# Altium schematic sheet Debugger.SchDoc
size A
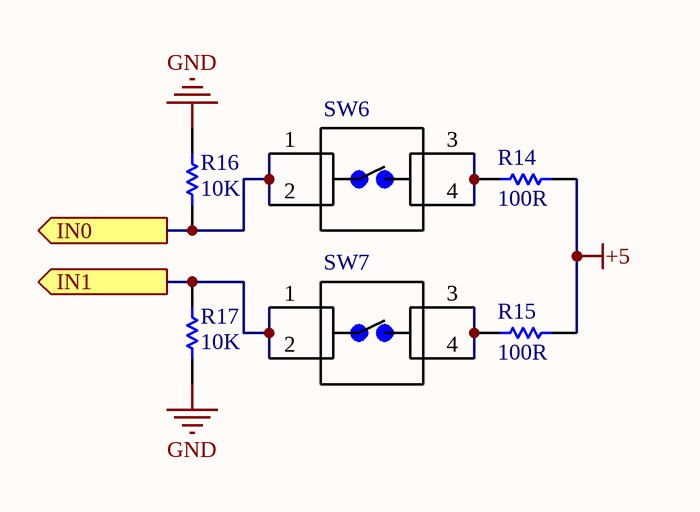
[diagram p0: Debugger.SchDoc]

## Parts
R14  100R  [RESC0805(2012)_L]
R15  100R  [RESC0805(2012)_L]
R16  10K  [RESC0805(2012)_L]
R17  10K  [RESC0805(2012)_L]
SW6  1825910-7  [Switch 6mm 24V (NO)]  (value not drawn)
SW7  1825910-7  [Switch 6mm 24V (NO)]  (value not drawn)

## Ports
IN0 (out), IN1 (out)

## Nets
+5: R14.1 R15.1
GND: R16.2 R17.1
IN0: R16.1 SW6.1 SW6.2 ; port IN0
IN1: R17.2 SW7.1 SW7.2 ; port IN1
NetR14_2: R14.2 SW6.3 SW6.4
NetR15_2: R15.2 SW7.3 SW7.4

## Library data of the parts
R14 R15 = CMP-1013-00397-1: 100R 0.125W 1% 0805 (2012 Metric)  SMD; Value: 100.00 Ohm; Case-Metric: 2012; Case-EIA: 0805; Technology: SMT; Power: 0.125 W; Tolerance: 1 %
R16 R17 = CMP-1013-00624-1: 10K2 0.125W 1% 0805 (2012 Metric)  SMD; Case-Metric: 2012; Case-EIA: 0805; Value: 10200.00 Ohm; Technology: SMT; Tolerance: 1 %; Power: 0.125 W
SW6 SW7 = Switch 6mm 24V (NO): FSM4JAH=6MM TACT SWITCH, HIGH TEMP; MF: TE Connectivity; Contact_Current_Rating: 50 mA; Configuration_Pole-Throw: Single Pole - Single Throw; Package: None; Digi-Key_Part_Number: 450-1804-ND; Digi-Key_Purchase_URL: https://www.digikey.com/product-detail/en/te-connectivity-alcoswitch-switches/1825910-7/450-1804-ND/1731414?utm_source=snapeda&utm_medium=aggregator&utm_campaign=symbol; MP: 1825910-7; SnapEDA_Link: https://www.snapeda.com/parts/1825910-7/TE%20Connectivity%20ALCOSWITCH%20Switches/view-part/?ref=snap; EU_RoHS_Compliance: Compliant; TE_purchase_URL: https://www.te.com/usa-en/product-1825910-7.html?te_bu=Cor&te_type=disp&te_campaign=seda_glo_cor-seda-global-disp-prtnr-fy19-seda-model-bom-cta_sma-317_1&elqCampaignId=32493; Value: *